# Altium schematic sheet ArduinoAndSensorsSCH.SchDoc
size A; SheetNumber: 1; SheetTotal: 1
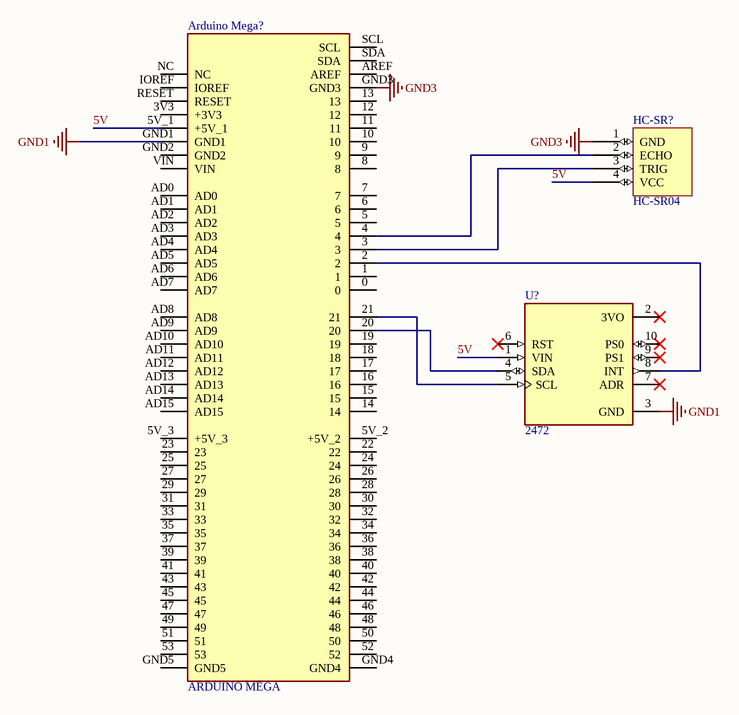
[diagram p0: ArduinoAndSensorsSCH.SchDoc]

## Parts
Arduino_Mega?  ARDUINO MEGA  [ARDUINO_A000067]
HC-SR?  HC-SR04  [PCBComponent_1]
U?  2472  [MODULE_2472]

## Nets
GND1: Arduino_Mega?.GND1 U?.3(GND)
GND3: Arduino_Mega?.GND3 HC-SR?.1(GND)
5V: Arduino_Mega?.5V_1(+5V_1) HC-SR?.4(VCC) U?.1(VIN)
NetArduino_Mega?_2: Arduino_Mega?.2 U?.8(INT)
NetArduino_Mega?_3: Arduino_Mega?.3 HC-SR?.3(TRIG)
NetArduino_Mega?_4: Arduino_Mega?.4 HC-SR?.2(ECHO)
NetArduino_Mega?_20: Arduino_Mega?.20 U?.4(SDA)
NetArduino_Mega?_21: Arduino_Mega?.21 U?.5(SCL)

Not connected (* = marked no-connect by the designer): Arduino_Mega? 0 1 3V3(+3V3) 5 5V_2(+5V_2) 5V_3(+5V_3) 6 7 8 9 10 11 12 13 14 15 16 17 18 19 22 23 24 25 26 27 28 29 30 31 32 33 34 35 36 37 38 39 40 41 42 43 44 45 46 47 48 49 50 51 52 53 AD0 AD1 AD2 AD3 AD4 AD5 AD6 AD7 AD8 AD9 AD10 AD11 AD12 AD13 AD14 AD15 AREF GND2 GND4 GND5 IOREF NC RESET SCL SDA VIN; U? 2(3VO)* 6(RST)* 7(ADR)* 9(PS1)* 10(PS0)*

## Library data of the parts
Arduino_Mega? = A000067: 8-bit board with 54 digital pins, 16 analog inputs, and 4 serial ports.; MP: Arduino Mega 2560 Rev3; SnapEDA_Link: https://www.snapeda.com/parts/Arduino%20Mega%202560%20Rev3/Arduino/view-part/?ref=snap; Package: Non-Standard Arduino; Value: *; MF: Arduino; Check_prices: https://www.snapeda.com/parts/Arduino%20Mega%202560%20Rev3/Arduino/view-part/?ref=eda
HC-SR? = Component_1
U? = 2472: Adafruit 9-DOF Absolute Orientation IMU Fusion Breakout - BNO055 | Adafruit Industries 2472; SnapEDA_Link: https://www.snapeda.com/parts/2472/Adafruit+Industries/view-part/?ref=snap; Package: Non-Standard Adafruit; Value: *; MF: Adafruit; MP: 2472; Check_prices: https://www.snapeda.com/parts/2472/Adafruit+Industries/view-part/?ref=eda